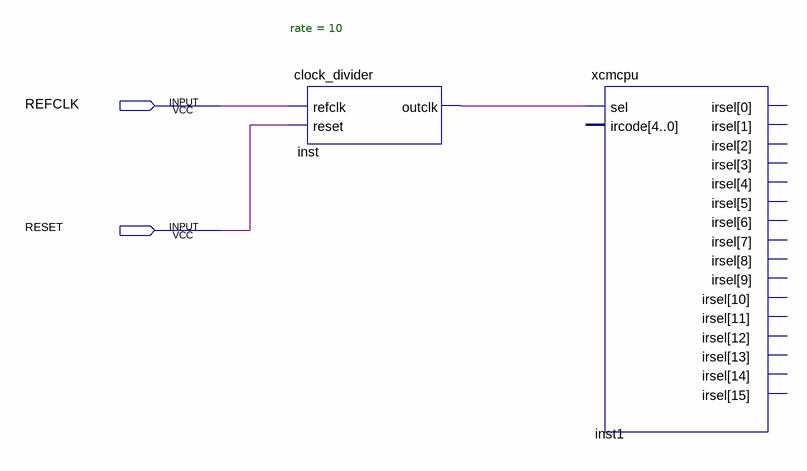
[diagram p0: schematic sheet]
// Quartus schematic xcm_fpga_proto.bdf as structural Verilog: 2 symbols, 2 pins
module xcm_fpga_proto (
  input  REFCLK,
  input  RESET
);

  wire inst_outclk;

  clock_divider #(.rate(10)) inst (.refclk(REFCLK), .reset(RESET), .outclk(inst_outclk));
  xcmcpu inst1 (.sel(inst_outclk));  // open: ircode, irsel
endmodule
